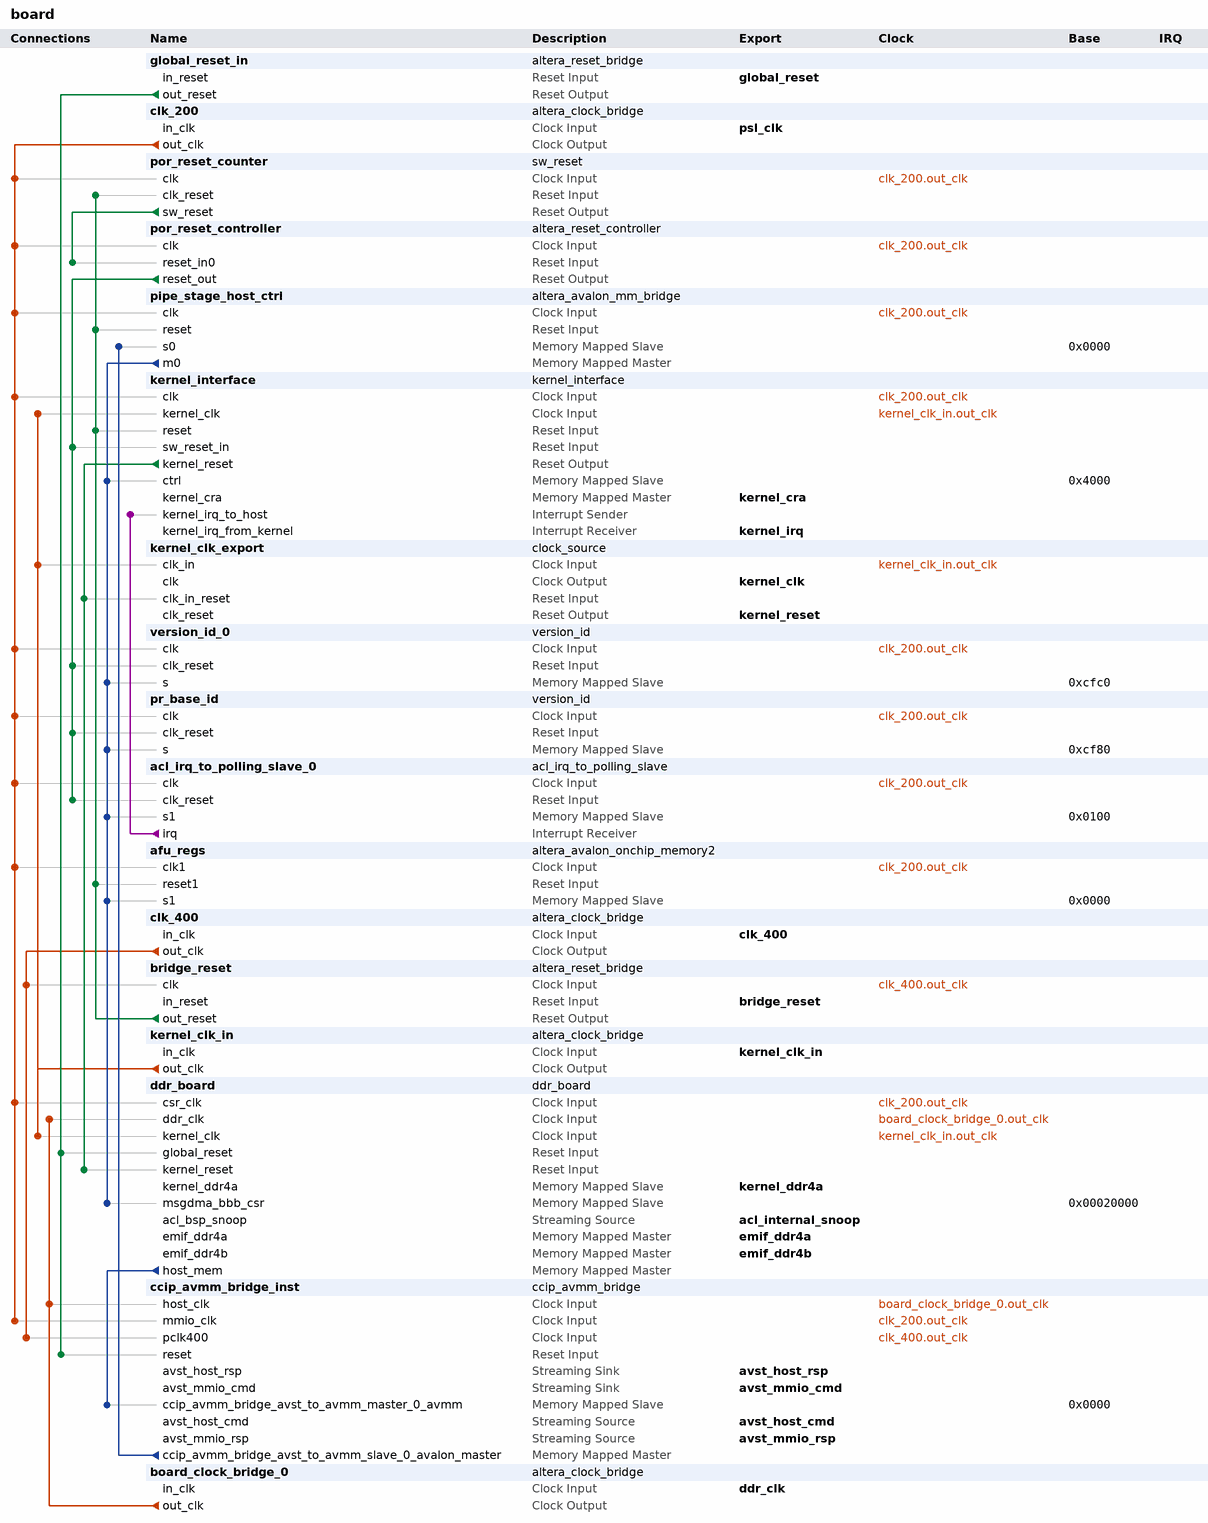
[diagram p0: system contents]
# Platform Designer (Qsys) system board, Arria 10 10AX115N3F40E2SG
# Parameters at their usual value, and those the tool derives, are not listed.
package require -exact qsys 1.0
create_system board
set_project_property DEVICE_FAMILY {Arria 10}
set_project_property DEVICE 10AX115N3F40E2SG

add_component global_reset_in ip/board/board_global_reset_in.ip altera_reset_bridge global_reset_in 17.0

add_component clk_200 ip/board/board_clk_200.ip altera_clock_bridge clk_200 17.0

add_component por_reset_counter ip/board/board_por_reset_counter.ip sw_reset por_reset_counter 10.0

add_component por_reset_controller ip/board/board_por_reset_controller.ip altera_reset_controller por_reset_controller 17.0

add_component pipe_stage_host_ctrl ip/board/board_pipe_stage_host_ctrl.ip altera_avalon_mm_bridge pipe_stage_host_ctrl 17.0
load_component pipe_stage_host_ctrl
set_component_parameter_value DATA_WIDTH 32
set_component_parameter_value ADDRESS_WIDTH 18
set_component_parameter_value USE_AUTO_ADDRESS_WIDTH 0
set_component_parameter_value ADDRESS_UNITS SYMBOLS
set_component_parameter_value MAX_PENDING_RESPONSES 1
save_component

add_component kernel_interface ip/board/board_kernel_interface.ip kernel_interface kernel_interface 15.1

add_component kernel_clk_export ip/board/board_kernel_clk_export.ip clock_source kernel_clk_export 
load_component kernel_clk_export
set_component_parameter_value clockFrequency 350000000
set_component_parameter_value clockFrequencyKnown false
set_component_parameter_value resetSynchronousEdges DEASSERT
save_component

add_component version_id_0 ip/board/board_version_id_0.ip version_id version_id_0 10.0

add_component pr_base_id ip/board/board_pr_base_id.ip version_id pr_base_id 10.0
load_component pr_base_id
set_component_parameter_value WIDTH 32
set_component_parameter_value VERSION_ID 1284905767
save_component

add_component acl_irq_to_polling_slave_0 ip/board/board_acl_irq_to_polling_slave_0.ip acl_irq_to_polling_slave acl_irq_to_polling_slave_0 10.0

add_component afu_regs ip/board/board_afu_regs.ip altera_avalon_onchip_memory2 afu_regs 17.0

add_component clk_400 ip/board/board_clk_400.ip altera_clock_bridge clk_400 17.0

add_component bridge_reset ip/board/board_bridge_reset.ip altera_reset_bridge bridge_reset 17.0

add_component kernel_clk_in ip/board/board_kernel_clk_in.ip altera_clock_bridge kernel_clk_in 17.0

add_instance ddr_board ddr_board 1.0

add_instance ccip_avmm_bridge_inst ccip_avmm_bridge 1.0

add_component board_clock_bridge_0 ip/board/board_clock_bridge_0.ip altera_clock_bridge board_clock_bridge_0 17.0

# connections
add_connection board_clock_bridge_0.out_clk ccip_avmm_bridge_inst.host_clk clock
add_connection board_clock_bridge_0.out_clk ddr_board.ddr_clk clock
add_connection clk_200.out_clk acl_irq_to_polling_slave_0.clk clock
add_connection clk_200.out_clk afu_regs.clk1 clock
add_connection clk_200.out_clk ccip_avmm_bridge_inst.mmio_clk clock
add_connection clk_200.out_clk ddr_board.csr_clk clock
add_connection clk_200.out_clk kernel_interface.clk clock
add_connection clk_200.out_clk pipe_stage_host_ctrl.clk clock
add_connection clk_200.out_clk por_reset_controller.clk clock
add_connection clk_200.out_clk por_reset_counter.clk clock
add_connection clk_200.out_clk pr_base_id.clk clock
add_connection clk_200.out_clk version_id_0.clk clock
add_connection clk_400.out_clk bridge_reset.clk clock
add_connection clk_400.out_clk ccip_avmm_bridge_inst.pclk400 clock
add_connection kernel_clk_in.out_clk ddr_board.kernel_clk clock
add_connection kernel_clk_in.out_clk kernel_clk_export.clk_in clock
add_connection kernel_clk_in.out_clk kernel_interface.kernel_clk clock
add_connection bridge_reset.out_reset afu_regs.reset1 reset
add_connection bridge_reset.out_reset kernel_interface.reset reset
add_connection bridge_reset.out_reset pipe_stage_host_ctrl.reset reset
add_connection bridge_reset.out_reset por_reset_counter.clk_reset reset
add_connection global_reset_in.out_reset ccip_avmm_bridge_inst.reset reset
add_connection global_reset_in.out_reset ddr_board.global_reset reset
add_connection kernel_interface.kernel_reset ddr_board.kernel_reset reset
add_connection kernel_interface.kernel_reset kernel_clk_export.clk_in_reset reset
add_connection por_reset_controller.reset_out acl_irq_to_polling_slave_0.clk_reset reset
add_connection por_reset_controller.reset_out kernel_interface.sw_reset_in reset
add_connection por_reset_controller.reset_out pr_base_id.clk_reset reset
add_connection por_reset_controller.reset_out version_id_0.clk_reset reset
add_connection por_reset_counter.sw_reset por_reset_controller.reset_in0 reset
add_connection ccip_avmm_bridge_inst.ccip_avmm_bridge_avst_to_avmm_slave_0_avalon_master pipe_stage_host_ctrl.s0 avalon
set_connection_parameter_value ccip_avmm_bridge_inst.ccip_avmm_bridge_avst_to_avmm_slave_0_avalon_master/pipe_stage_host_ctrl.s0 baseAddress 0x0000
add_connection ddr_board.host_mem ccip_avmm_bridge_inst.ccip_avmm_bridge_avst_to_avmm_master_0_avmm avalon
set_connection_parameter_value ddr_board.host_mem/ccip_avmm_bridge_inst.ccip_avmm_bridge_avst_to_avmm_master_0_avmm baseAddress 0x0000
add_connection pipe_stage_host_ctrl.m0 acl_irq_to_polling_slave_0.s1 avalon
set_connection_parameter_value pipe_stage_host_ctrl.m0/acl_irq_to_polling_slave_0.s1 baseAddress 0x0100
add_connection pipe_stage_host_ctrl.m0 afu_regs.s1 avalon
set_connection_parameter_value pipe_stage_host_ctrl.m0/afu_regs.s1 baseAddress 0x0000
add_connection pipe_stage_host_ctrl.m0 ddr_board.msgdma_bbb_csr avalon
set_connection_parameter_value pipe_stage_host_ctrl.m0/ddr_board.msgdma_bbb_csr baseAddress 0x00020000
add_connection pipe_stage_host_ctrl.m0 kernel_interface.ctrl avalon
set_connection_parameter_value pipe_stage_host_ctrl.m0/kernel_interface.ctrl baseAddress 0x4000
add_connection pipe_stage_host_ctrl.m0 pr_base_id.s avalon
set_connection_parameter_value pipe_stage_host_ctrl.m0/pr_base_id.s baseAddress 0xcf80
add_connection pipe_stage_host_ctrl.m0 version_id_0.s avalon
set_connection_parameter_value pipe_stage_host_ctrl.m0/version_id_0.s baseAddress 0xcfc0
add_connection acl_irq_to_polling_slave_0.irq kernel_interface.kernel_irq_to_host interrupt

# exported interfaces
add_interface acl_internal_snoop avalon_streaming source
set_interface_property acl_internal_snoop EXPORT_OF ddr_board.acl_bsp_snoop
add_interface avst_host_cmd avalon_streaming source
set_interface_property avst_host_cmd EXPORT_OF ccip_avmm_bridge_inst.avst_host_cmd
add_interface avst_host_rsp avalon_streaming sink
set_interface_property avst_host_rsp EXPORT_OF ccip_avmm_bridge_inst.avst_host_rsp
add_interface avst_mmio_cmd avalon_streaming sink
set_interface_property avst_mmio_cmd EXPORT_OF ccip_avmm_bridge_inst.avst_mmio_cmd
add_interface avst_mmio_rsp avalon_streaming source
set_interface_property avst_mmio_rsp EXPORT_OF ccip_avmm_bridge_inst.avst_mmio_rsp
add_interface bridge_reset reset sink
set_interface_property bridge_reset EXPORT_OF bridge_reset.in_reset
add_interface clk_400 clock sink
set_interface_property clk_400 EXPORT_OF clk_400.in_clk
add_interface ddr_clk clock sink
set_interface_property ddr_clk EXPORT_OF board_clock_bridge_0.in_clk
add_interface emif_ddr4a avalon master
set_interface_property emif_ddr4a EXPORT_OF ddr_board.emif_ddr4a
add_interface emif_ddr4b avalon master
set_interface_property emif_ddr4b EXPORT_OF ddr_board.emif_ddr4b
add_interface global_reset reset sink
set_interface_property global_reset EXPORT_OF global_reset_in.in_reset
add_interface kernel_clk clock source
set_interface_property kernel_clk EXPORT_OF kernel_clk_export.clk
add_interface kernel_clk_in clock sink
set_interface_property kernel_clk_in EXPORT_OF kernel_clk_in.in_clk
add_interface kernel_cra avalon master
set_interface_property kernel_cra EXPORT_OF kernel_interface.kernel_cra
add_interface kernel_ddr4a avalon slave
set_interface_property kernel_ddr4a EXPORT_OF ddr_board.kernel_ddr4a
add_interface kernel_irq interrupt receiver
set_interface_property kernel_irq EXPORT_OF kernel_interface.kernel_irq_from_kernel
add_interface kernel_reset reset source
set_interface_property kernel_reset EXPORT_OF kernel_clk_export.clk_reset
add_interface psl_clk clock sink
set_interface_property psl_clk EXPORT_OF clk_200.in_clk

set_interconnect_requirement {$system} qsys_mm.clockCrossingAdapter FIFO
set_interconnect_requirement {$system} qsys_mm.maxAdditionalLatency 4

save_system board.qsys
